# EasyEDA Pro project ProPrj_智能车主控V5.0-20251108_2026-08-26.epro, schematic Schematic2
Assembly Variant: Basic; Board Name: 光电管; Create Date: 2026-05-29; Page Name: P1; Project Name: 智能车主控V4.1-20251108; Schematic Name: Schematic2; Update Date: 2026-05-31; Company: 嘉立创EDA; Page Size: A4; Version: V1.0
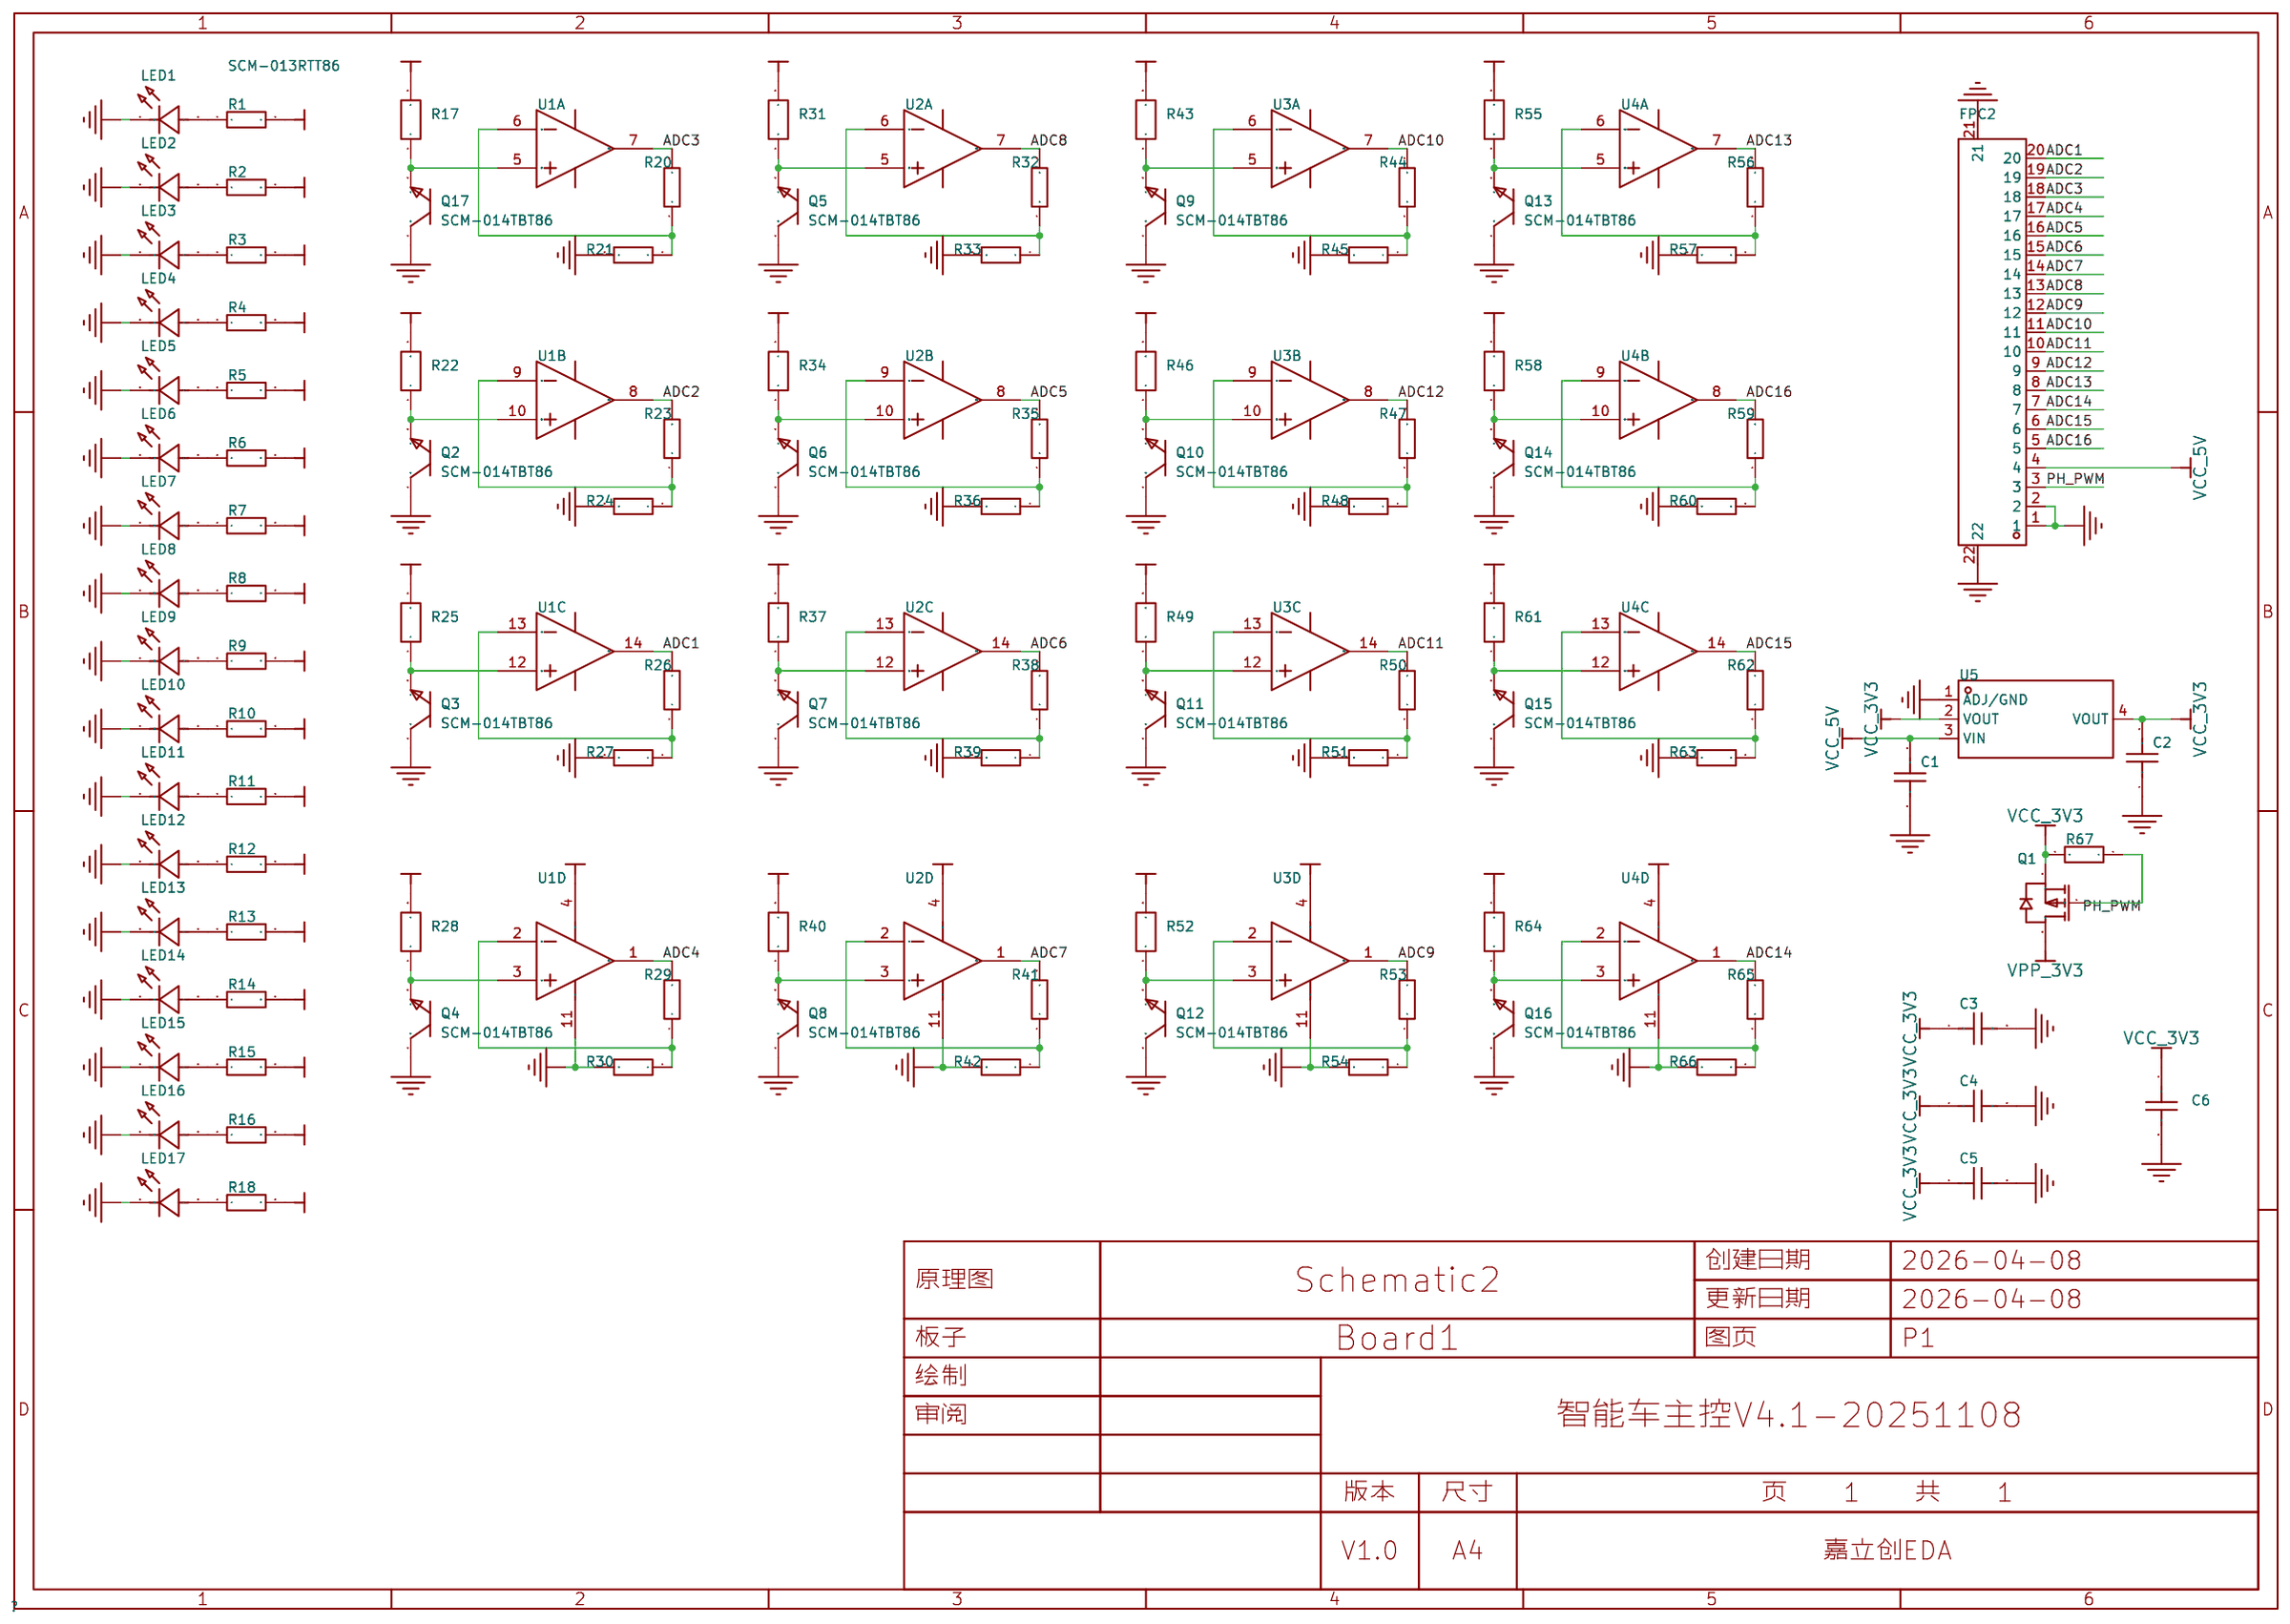
[diagram p0: schematic sheet]

## Parts
C1  10uF  [C0603]
C2  10uF  [C0603]
C3  100nF  [C0603]
C4  100nF  [C0603]
C5  100nF  [C0603]
C6  100nF  [C0603]
FPC2  FPC-05F-20PH20  [FPC-SMD_20P-P0.50_XUNPU_FPC-05F-20PH20]
LED1  SCM-013RTT86  [LED-SMD_L3.0-W1.5-RD_SCM-013RTT86]
LED2  SCM-013RTT86  [LED-SMD_L3.0-W1.5-RD_SCM-013RTT86]
LED3  SCM-013RTT86  [LED-SMD_L3.0-W1.5-RD_SCM-013RTT86]
LED4  SCM-013RTT86  [LED-SMD_L3.0-W1.5-RD_SCM-013RTT86]
LED5  SCM-013RTT86  [LED-SMD_L3.0-W1.5-RD_SCM-013RTT86]
LED6  SCM-013RTT86  [LED-SMD_L3.0-W1.5-RD_SCM-013RTT86]
LED7  SCM-013RTT86  [LED-SMD_L3.0-W1.5-RD_SCM-013RTT86]
LED8  SCM-013RTT86  [LED-SMD_L3.0-W1.5-RD_SCM-013RTT86]
LED9  SCM-013RTT86  [LED-SMD_L3.0-W1.5-RD_SCM-013RTT86]
LED10  SCM-013RTT86  [LED-SMD_L3.0-W1.5-RD_SCM-013RTT86]
LED11  SCM-013RTT86  [LED-SMD_L3.0-W1.5-RD_SCM-013RTT86]
LED12  SCM-013RTT86  [LED-SMD_L3.0-W1.5-RD_SCM-013RTT86]
LED13  SCM-013RTT86  [LED-SMD_L3.0-W1.5-RD_SCM-013RTT86]
LED14  SCM-013RTT86  [LED-SMD_L3.0-W1.5-RD_SCM-013RTT86]
LED15  SCM-013RTT86  [LED-SMD_L3.0-W1.5-RD_SCM-013RTT86]
LED16  SCM-013RTT86  [LED-SMD_L3.0-W1.5-RD_SCM-013RTT86]
LED17  SCM-013RTT86  [LED-SMD_L3.0-W1.5-RD_SCM-013RTT86]
Q1  PMF170XP,115  [SOT-323-3_L2.0-W1.3-P1.30-LS2.1-BR]
Q2  SCM-014TBT86  [LED-SMD_L3.0-W1.5-RD]
Q3  SCM-014TBT86  [LED-SMD_L3.0-W1.5-RD]
Q4  SCM-014TBT86  [LED-SMD_L3.0-W1.5-RD]
Q5  SCM-014TBT86  [LED-SMD_L3.0-W1.5-RD]
Q6  SCM-014TBT86  [LED-SMD_L3.0-W1.5-RD]
Q7  SCM-014TBT86  [LED-SMD_L3.0-W1.5-RD]
Q8  SCM-014TBT86  [LED-SMD_L3.0-W1.5-RD]
Q9  SCM-014TBT86  [LED-SMD_L3.0-W1.5-RD]
Q10  SCM-014TBT86  [LED-SMD_L3.0-W1.5-RD]
Q11  SCM-014TBT86  [LED-SMD_L3.0-W1.5-RD]
Q12  SCM-014TBT86  [LED-SMD_L3.0-W1.5-RD]
Q13  SCM-014TBT86  [LED-SMD_L3.0-W1.5-RD]
Q14  SCM-014TBT86  [LED-SMD_L3.0-W1.5-RD]
Q15  SCM-014TBT86  [LED-SMD_L3.0-W1.5-RD]
Q16  SCM-014TBT86  [LED-SMD_L3.0-W1.5-RD]
Q17  SCM-014TBT86  [LED-SMD_L3.0-W1.5-RD]
R1  100R  [R0603]
R2  100R  [R0603]
R3  100R  [R0603]
R4  100R  [R0603]
R5  100R  [R0603]
R6  100R  [R0603]
R7  100R  [R0603]
R8  100R  [R0603]
R9  100R  [R0603]
R10  100R  [R0603]
R11  100R  [R0603]
R12  100R  [R0603]
R13  100R  [R0603]
R14  100R  [R0603]
R15  100R  [R0603]
R16  100R  [R0603]
R17  4.7MΩ  [R0603]
R18  100R  [R0603]
R20  10K  [R0603]
R21  1K  [R0603]
R22  4.7MΩ  [R0603]
R23  10K  [R0603]
R24  1K  [R0603]
R25  4.7MΩ  [R0603]
R26  10K  [R0603]
R27  1K  [R0603]
R28  4.7MΩ  [R0603]
R29  10K  [R0603]
R30  1K  [R0603]
R31  4.7MΩ  [R0603]
R32  10K  [R0603]
R33  1K  [R0603]
R34  4.7MΩ  [R0603]
R35  10K  [R0603]
R36  1K  [R0603]
R37  4.7MΩ  [R0603]
R38  10K  [R0603]
R39  1K  [R0603]
R40  4.7MΩ  [R0603]
R41  10K  [R0603]
R42  1K  [R0603]
R43  4.7MΩ  [R0603]
R44  10K  [R0603]
R45  1K  [R0603]
R46  4.7MΩ  [R0603]
R47  10K  [R0603]
R48  1K  [R0603]
R49  4.7MΩ  [R0603]
R50  10K  [R0603]
R51  1K  [R0603]
R52  4.7MΩ  [R0603]
R53  10K  [R0603]
R54  1K  [R0603]
R55  4.7MΩ  [R0603]
R56  10K  [R0603]
R57  1K  [R0603]
R58  4.7MΩ  [R0603]
R59  10K  [R0603]
R60  1K  [R0603]
R61  4.7MΩ  [R0603]
R62  10K  [R0603]
R63  1K  [R0603]
R64  4.7MΩ  [R0603]
R65  10K  [R0603]
R66  1K  [R0603]
R67  10K  [R0603]
U1  OPA4377AIPWR  [TSSOP-14_L5.0-W4.4-P0.65-LS6.4-BL]  (sections 1,2,3,4)
U2  OPA4377AIPWR  [TSSOP-14_L5.0-W4.4-P0.65-LS6.4-BL]  (sections 1,2,3,4)
U3  OPA4377AIPWR  [TSSOP-14_L5.0-W4.4-P0.65-LS6.4-BL]  (sections 1,2,3,4)
U4  OPA4377AIPWR  [TSSOP-14_L5.0-W4.4-P0.65-LS6.4-BL]  (sections 1,2,3,4)
U5  AMS1117-3.3  [SOT-223_L6.5-W3.5-P2.30-LS7.0-BR]

## Library data of the parts
C1-C6 = CAP_0603: Supplier Footprint: 0603
FPC2 = FPC-05F-20PH20: 锁定特性:翻盖式;触点类型:卧贴;触点数量:20P;间距:0.5mm;安装方式:下接;工作温度:-25℃~+85℃;; LCSC Part Name: 翻盖式 卧贴 P数:20P 间距:0.5mm; Supplier Part: C2856803; Manufacturer: XUNPU(讯普); Supplier Footprint: SMD,P=0.5mm,卧贴; JLCPCB Part Class: Extended Part; Datasheet: https://item.szlcsc.com/datasheet/FPC-05F-20PH20/3056901.html; Supplier: LCSC; Locking Feature: 翻盖式; Contact Type: 卧贴; Number of Contacts: 20P; Pitch: 0.5mm; Mounting Type: 下接; FFC, FCB Thickness: 0.3mm; Height Above Board: 2mm; Contact Material: 磷青铜; Contact Plating: 锡; Operating Temperature: -25℃~+85℃; Rated Voltage (Max): 50V; Current Rating (Max): 500mA
LED1-LED17 = SCM-013RTT86: 正向压降(Vf):1.4V;功率:57mW;正向电流:20mA;二极管配置:独立二极管;工作温度:-40℃~+85℃;; LCSC Part Name: 贴片式透镜红外发光二极管; Supplier Part: C4355011; Manufacturer: ROHM(罗姆); Supplier Footprint: SMD,3x1.5mm; Datasheet: https://item.szlcsc.com/datasheet/SCM-013RTT86/4925329.html; Supplier: LCSC; Voltage - Forward(Vf): 1.4V; Power(Watts): 57mW; Forward Current: 20mA; Peak Wavelength: 850nm; Diode Configuration: 独立二极管; Operating Temperature: -40℃~+85℃
Q1 = PMF170XP,115: LCSC Part Name: 1个P沟道 耐压:20V 电流:1A; Supplier Part: C389353; Manufacturer: Nexperia(安世); Supplier Footprint: SOT-323; JLCPCB Part Class: Extended Part; Datasheet: https://item.szlcsc.com/datasheet/PMF170XP%252C115/364769.html; Supplier: LCSC; Number: 1个P沟道; Drain to Source Voltage: 20V; Current - Continuous Drain(Id): 1A; RDS(on): 200mΩ@4.5V; Pd - Power Dissipation: 360mW; Gate Threshold Voltage (Vgs(th)): 1.15V@250uA; Gate Charge(Qg): 3.9nC@4.5V; Input Capacitance(Ciss): 280pF@10V; Reverse Transfer Capacitance (Crss@Vds): 30pF@10V; Operating Temperature: -55℃~+150℃; Type: P沟道
Q2-Q17 = SCM-014TBT86: 特性：表面贴装透镜光电晶体管; Supplier Part: C4748836; Manufacturer: ROHM(罗姆); Supplier Footprint: SMD; JLCPCB Part Class: 扩展库; Datasheet: https://item.szlcsc.com/datasheet/SCM-014TBT86/5321051.html; Supplier: LCSC
R1-R16 R18 R20 R21 R23 R24 R26 R27 R29 R30 R32 R33 R35 R36 R38 R39 R41 R42 R44 R45 R47 R48 R50 R51 R53 R54 R56 R57 R59 R60 R62 R63 R65-R67 = Res_0603: Supplier Footprint: 0603
R17 R22 R25 R28 R31 R34 R37 R40 R43 R46 R49 R52 R55 R58 R61 R64 = FRC0603F4704TS: LCSC Part Name: 4.7MΩ ±1% 100mW 厚膜电阻; Supplier Part: C2930153; Manufacturer: FOJAN(富捷); Supplier Footprint: 0603; JLCPCB Part Class: Extended Part; Supplier: LCSC; Type: 厚膜电阻; Tolerance: ±1%; Power(Watts): 100mW; Voltage-Supply(Max): 75V; Temperature Coefficient: ±100ppm/℃; Operating Temperature: -55℃~+155℃
U1-U4 = OPA4377AIPWR: LCSC Part Name: 5MHz低噪声单通道、双通道、四通道CMOS运算放大器; Supplier Part: C130012; Manufacturer: TI(德州仪器); Supplier Footprint: TSSOP-14; JLCPCB Part Class: Extended Part; Datasheet: https://www.ti.com/cn/lit/gpn/opa4377; Supplier: LCSC
U5 = AMS1117-3.3_C426566: LCSC Part Name: 3.3V 800mA 18V; Supplier Part: C426566; Manufacturer: Slkor(萨科微); Supplier Footprint: SOT-223; JLCPCB Part Class: Extended Part; Datasheet: https://item.szlcsc.com/datasheet/AMS1117-3.3/420485.html; Supplier: LCSC; Output Type: 固定; Voltage - Supply: 18V; Output Voltage: 3.3V; Output Current: 800mA; Power Supply Rejection Ratio (PSRR): 70dB@(120Hz); Voltage Dropout: 1.3V@(0.8A); standby current: 3mA; Features: 过热保护; Operating Temperature: -40℃~+125℃; Output Configuration: 正极; Number of Outputs: 1

## Nets
GND: C1.1 C2.1 C3.2 C4.2 C5.2 C6.2 FPC2.1 FPC2.2 FPC2.21 FPC2.22 LED1.1(C) LED2.1(C) LED3.1(C) LED4.1(C) LED5.1(C) LED6.1(C) LED7.1(C) LED8.1(C) LED9.1(C) LED10.1(C) LED11.1(C) LED12.1(C) LED13.1(C) LED14.1(C) LED15.1(C) LED16.1(C) LED17.1(C) Q2.1(C) Q3.1(C) Q4.1(C) Q5.1(C) Q6.1(C) Q7.1(C) Q8.1(C) Q9.1(C) Q10.1(C) Q11.1(C) Q12.1(C) Q13.1(C) Q14.1(C) Q15.1(C) Q16.1(C) Q17.1(C) R21.2 R24.2 R27.2 R30.2 R33.2 R36.2 R39.2 R42.2 R45.2 R48.2 R51.2 R54.2 R57.2 R60.2 R63.2 R66.2 U1.11(V-) U2.11(V-) U3.11(V-) U4.11(V-) U5.1(ADJ/GND)
VCC_3V3: C2.2 C3.1 C4.1 C5.1 C6.1 Q1.2(S) R17.2 R22.2 R25.2 R28.2 R31.2 R34.2 R37.2 R40.2 R43.2 R46.2 R49.2 R52.2 R55.2 R58.2 R61.2 R64.2 R67.2 U1.4(V+) U2.4(V+) U3.4(V+) U4.4(V+) U5.2(VOUT) U5.4(VOUT)
VCC_5V: C1.2 FPC2.4 U5.3(VIN)
ADC1: FPC2.20 R26.2 U1.14(OUT D)
ADC2: FPC2.19 R23.2 U1.8(OUT C)
ADC3: FPC2.18 R20.2 U1.7(OUT B)
ADC4: FPC2.17 R29.2 U1.1(OUT A)
ADC5: FPC2.16 R35.2 U2.8(OUT C)
ADC6: FPC2.15 R38.2 U2.14(OUT D)
ADC7: FPC2.14 R41.2 U2.1(OUT A)
ADC8: FPC2.13 R32.2 U2.7(OUT B)
ADC9: FPC2.12 R53.2 U3.1(OUT A)
ADC10: FPC2.11 R44.2 U3.7(OUT B)
ADC11: FPC2.10 R50.2 U3.14(OUT D)
ADC12: FPC2.9 R47.2 U3.8(OUT C)
ADC13: FPC2.8 R56.2 U4.7(OUT B)
ADC14: FPC2.7 R65.2 U4.1(OUT A)
ADC15: FPC2.6 R62.2 U4.14(OUT D)
ADC16: FPC2.5 R59.2 U4.8(OUT C)
PH_PWM: FPC2.3 Q1.1(G) R67.1
VPP_3V3: Q1.3(D) R1.2 R2.2 R3.2 R4.2 R5.2 R6.2 R7.2 R8.2 R9.2 R10.2 R11.2 R12.2 R13.2 R14.2 R15.2 R16.2 R18.2
$1N59: R20.1 R21.1 U1.6(IN B-)
$1N65: R23.1 R24.1 U1.9(IN C-)
$1N71: R26.1 R27.1 U1.13(IN D-)
$1N78: R29.1 R30.1 U1.2(IN A-)
$1N83: R41.1 R42.1 U2.2(IN A-)
$1N86: R38.1 R39.1 U2.13(IN D-)
$1N89: R35.1 R36.1 U2.9(IN C-)
$1N92: R32.1 R33.1 U2.6(IN B-)
$1N108: R53.1 R54.1 U3.2(IN A-)
$1N111: R50.1 R51.1 U3.13(IN D-)
$1N114: R47.1 R48.1 U3.9(IN C-)
$1N117: R44.1 R45.1 U3.6(IN B-)
$1N133: R65.1 R66.1 U4.2(IN A-)
$1N136: R62.1 R63.1 U4.13(IN D-)
$1N139: R59.1 R60.1 U4.9(IN C-)
$1N142: R56.1 R57.1 U4.6(IN B-)
$1N7034: LED1.2(A) R1.1
$1N7069: LED2.2(A) R2.1
$1N7104: LED3.2(A) R3.1
$1N7139: LED4.2(A) R4.1
$1N7174: LED5.2(A) R5.1
$1N7209: LED6.2(A) R6.1
$1N7244: LED7.2(A) R7.1
$1N7279: LED8.2(A) R8.1
$1N7314: LED9.2(A) R9.1
$1N7349: LED10.2(A) R10.1
$1N7384: LED11.2(A) R11.1
$1N7419: LED12.2(A) R12.1
$1N7454: LED13.2(A) R13.1
$1N7489: LED14.2(A) R14.1
$1N7524: LED15.2(A) R15.1
$1N7559: LED16.2(A) R16.1
$1N7594: LED17.2(A) R18.1
Net-(Q2-2): Q2.2(E) R22.1 U1.10(IN C+)
Net-(Q3-2): Q3.2(E) R25.1 U1.12(IN D+)
Net-(Q4-2): Q4.2(E) R28.1 U1.3(IN A+)
Net-(Q5-2): Q5.2(E) R31.1 U2.5(IN B+)
Net-(Q6-2): Q6.2(E) R34.1 U2.10(IN C+)
Net-(Q7-2): Q7.2(E) R37.1 U2.12(IN D+)
Net-(Q8-2): Q8.2(E) R40.1 U2.3(IN A+)
Net-(Q9-2): Q9.2(E) R43.1 U3.5(IN B+)
Net-(Q10-2): Q10.2(E) R46.1 U3.10(IN C+)
Net-(Q11-2): Q11.2(E) R49.1 U3.12(IN D+)
Net-(Q12-2): Q12.2(E) R52.1 U3.3(IN A+)
Net-(Q13-2): Q13.2(E) R55.1 U4.5(IN B+)
Net-(Q14-2): Q14.2(E) R58.1 U4.10(IN C+)
Net-(Q15-2): Q15.2(E) R61.1 U4.12(IN D+)
Net-(Q16-2): Q16.2(E) R64.1 U4.3(IN A+)
Net-(Q17-2): Q17.2(E) R17.1 U1.5(IN B+)
